# EAGLE schematic schematic (EAGLE 6.5.0)
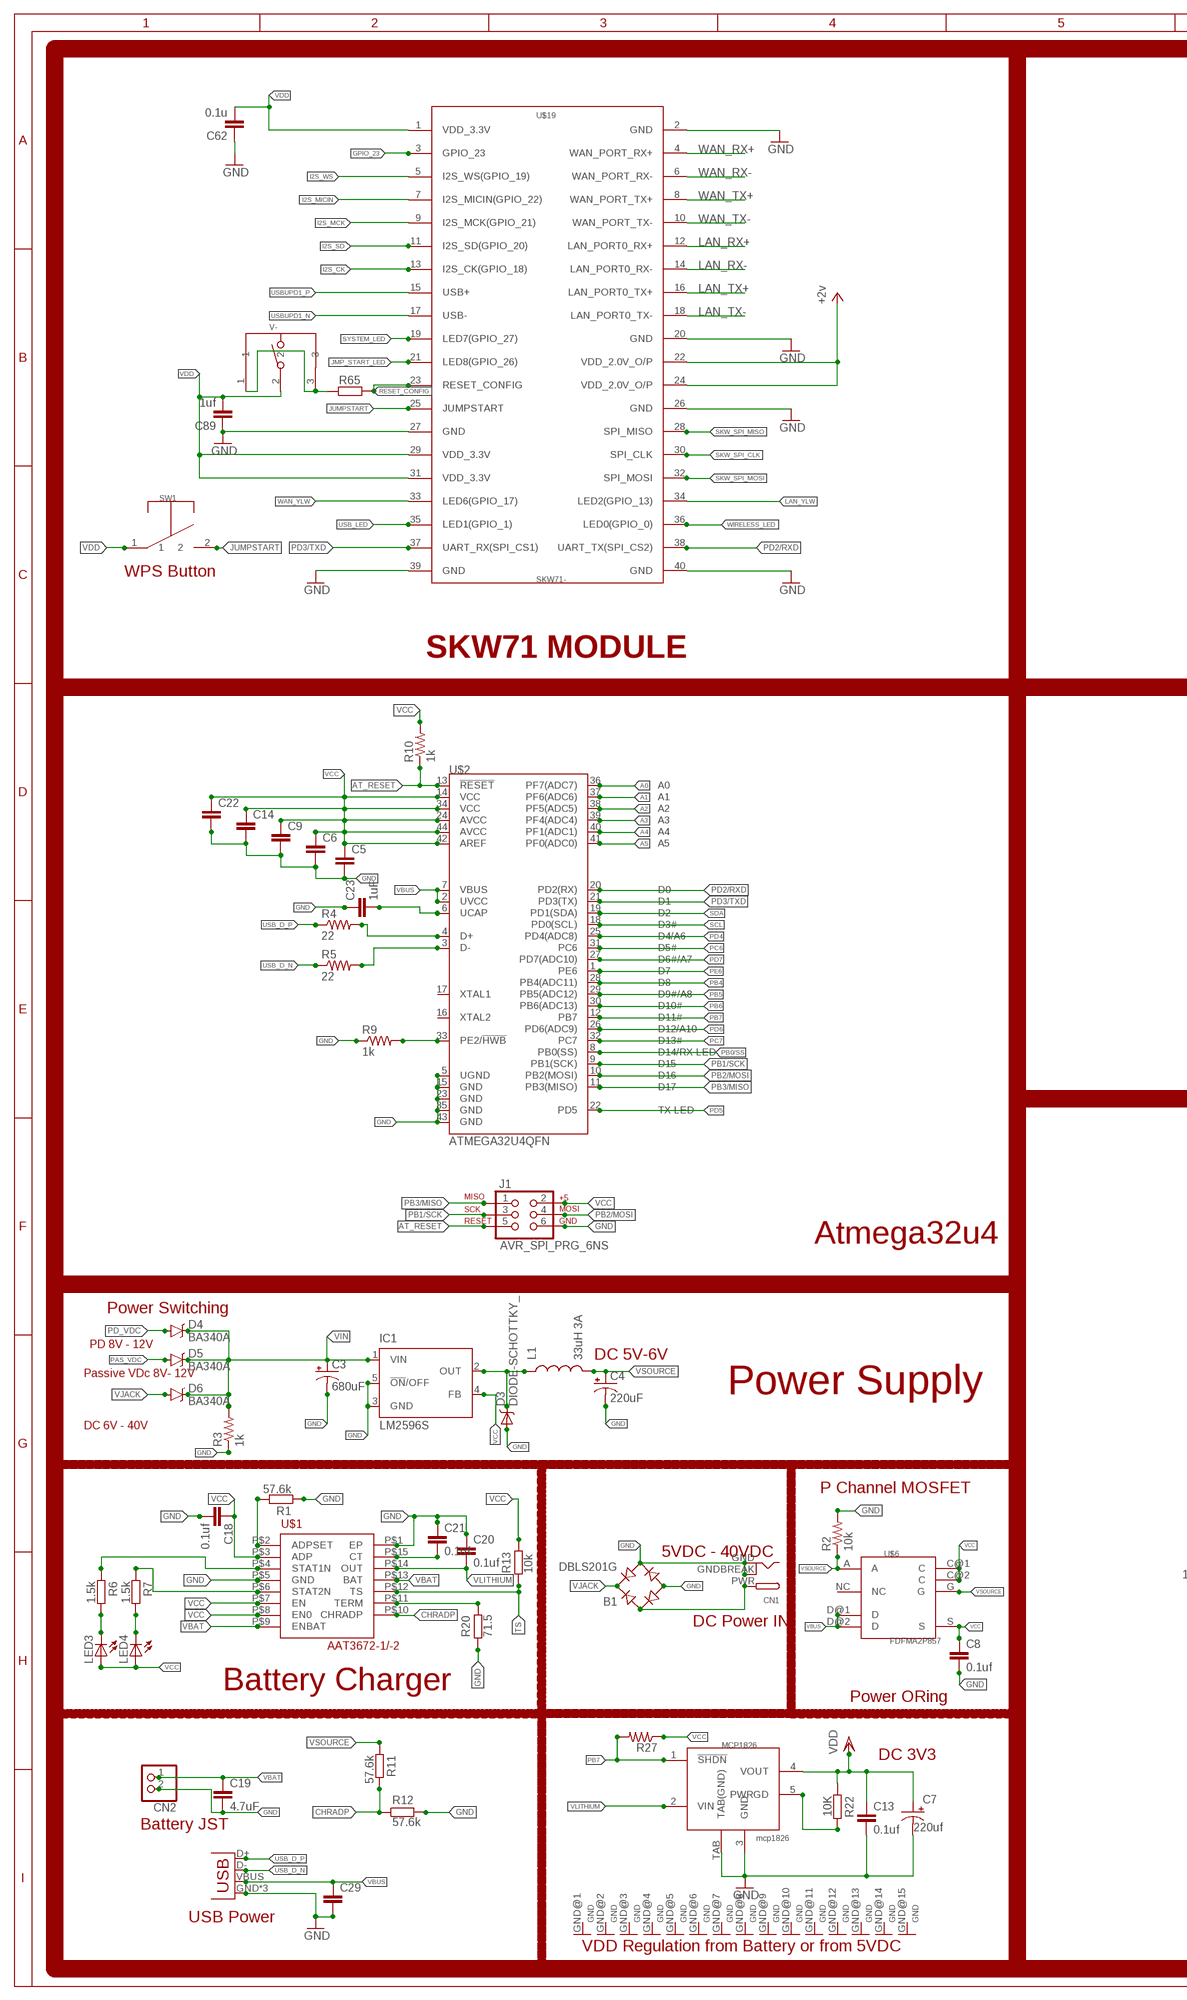
[diagram p0: schematic, sheet 1, part 1 of 2]
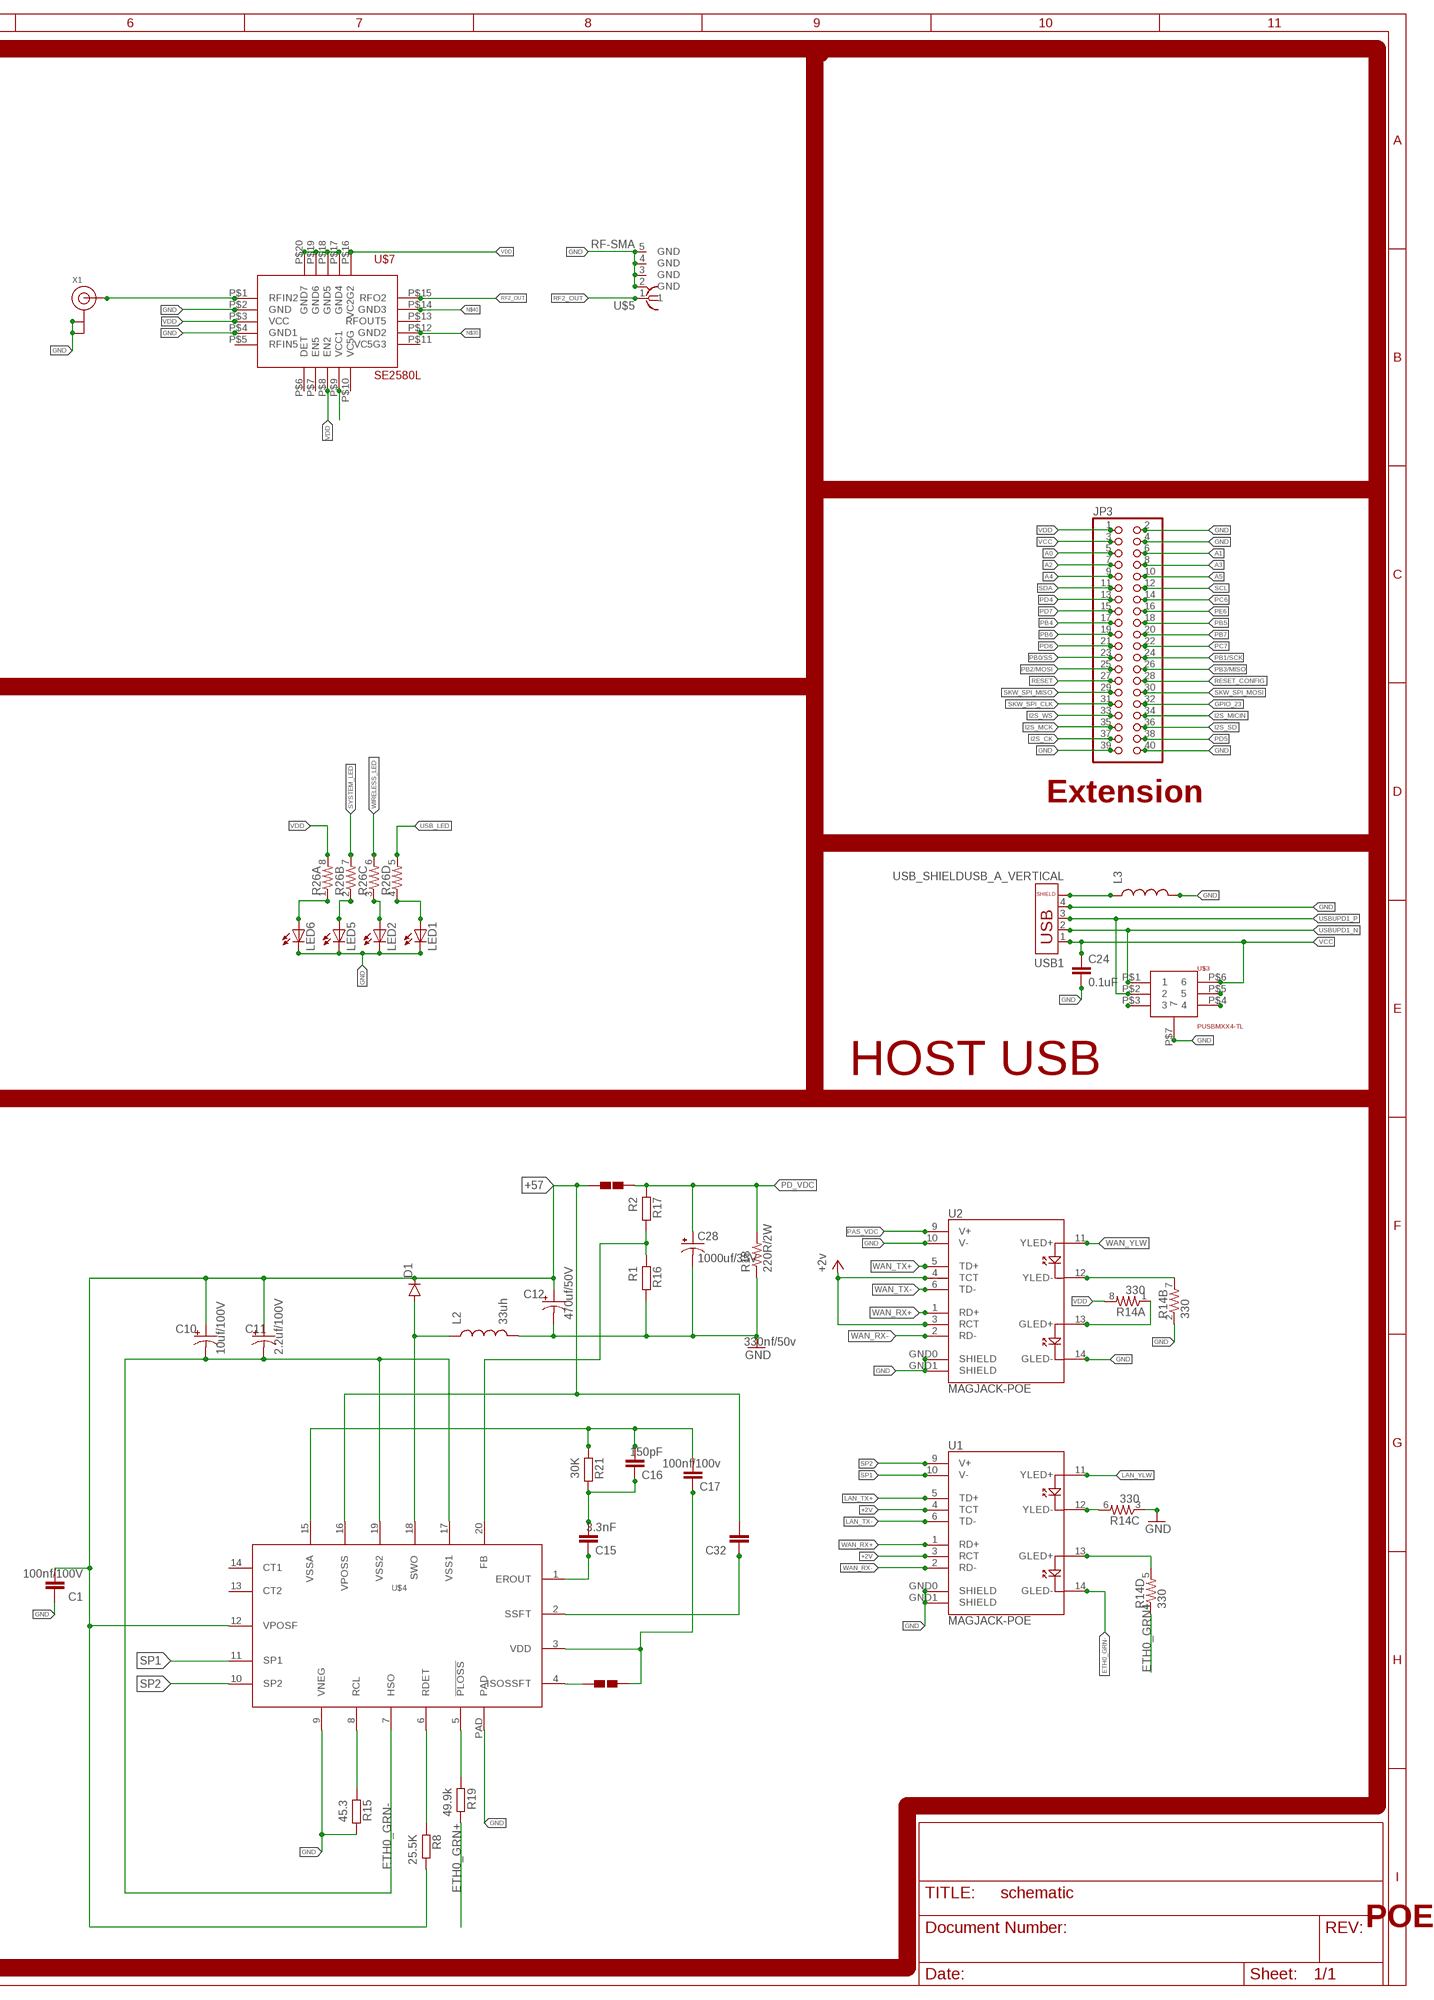
[diagram p1: schematic, sheet 1, part 2 of 2]

## Parts
B1  DBLS201G  [DBS]
C1  100nf/100V  C-EUC0805  [C0805]
C3  680uF  CPOL-USE3.5-10  [E3,5-10]
C4  220uF  CPOL-USE5-10.5  [E5-10,5]
C5  CAP0402-CAP  [0402-CAP]
C6  CAP0402-CAP  [0402-CAP]
C7  220uf  CPOL-USE5-10.5  [E5-10,5]
C8  0.1uf  C-EUC0603  [C0603]
C9  CAP0402-CAP  [0402-CAP]
C10  10uf/100V  CPOL-USE2,5-6E  [E2,5-6E]
C11  2.2uf/100V  CPOL-USE2-5  [E2-5]
C12  470uf/50V  CPOL-USE5-10.5  [E5-10,5]
C13  0.1uf  C-EUC0603  [C0603]
C14  CAP0402-CAP  [0402-CAP]
C15  3.3nF  C-EUC0805  [C0805]
C16  150pF  C-EUC0805  [C0805]
C17  100nf/100v  C-EUC0805  [C0805]
C18  0.1uf  C-EUC0603  [C0603]
C19  4.7uF  C-EUC0603  [C0603]
C20  0.1uf  C-EUC0603  [C0603]
C21  0.1uf  C-EUC0603  [C0603]
C22  CAP0402-CAP  [0402-CAP]
C23  1uF  CAP0402-CAP  [0402-CAP]
C24  0.1uF  CAP0402-CAP  [0402-CAP]
C28  1000uf/35V  CPOL-USE5-13  [E5-13]
C29  CAP0402-CAP  [0402-CAP]
C32  330nf/50v  C-EUC0805  [C0805]
C62  0.1u  CAPACITOR  [C0603]
C89  1uf  CAPACITOR  [C0603]
CN1  DCBARRELPTH  [DCJACK_2MM_PTH]
CN2  JST_2PIN-THM  [JST-PH-2-THM]
D1  DIODESMC/DO-214AB  [SMC]
D3  DIODE-SCHOTTKY_  [SMA-DIODE]
D4  BA340A  B340A  [SMA-DIODE]
D5  BA340A  B340A  [SMA-DIODE]
D6  BA340A  B340A  [SMA-DIODE]
IC1  LM2596S  [TO263-5]
J1  AVR_SPI_PRG_6NS  [2X3-NS]
JP3  PINHD-2X20  [2X20]
JP4  USB-MICROB  [USB-MICROB]
L1  33uH 3A  INDUCTOR  [INDUCTOR-10X9.8X6]
L2  33uh  INDUCTOR  [INDUCTOR-10X9.8X6]
L3  INDUCTOR0402  [C0402]
LED1  LED3MM  [LED3MM]
LED2  LED3MM  [LED3MM]
LED3  LEDCHIP-LED0603  [CHIP-LED0603]
LED4  LEDCHIP-LED0603  [CHIP-LED0603]
LED5  LED3MM  [LED3MM]
LED6  LED3MM  [LED3MM]
MCP1826  mcp1826  MCP1825T  [SOT223-5]
R1  57.6k  R-EU_R0402  [R0402]
R2  10k  RESISTOR0402-RES  [0402-RES]
R3  1k  RESISTOR0402-RES  [0402-RES]
R4  22  RESISTOR0402-RES  [0402-RES]
R5  22  RESISTOR0402-RES  [0402-RES]
R6  1.5k  R-EU_R0402  [R0402]
R7  1.5k  R-EU_R0402  [R0402]
R8  25.5K  RESISTOR  [R0603]
R9  1k  RESISTOR0402-RES  [0402-RES]
R10  1k  RESISTOR0402-RES  [0402-RES]
R11  57.6k  R-EU_R0402  [R0402]
R12  57.6k  R-EU_R0402  [R0402]
R13  10k  R-EU_R0402  [R0402]
R14  330  RESISTOR-ARRAY0603-ARV  [0603-ARV]
R15  45.3  RESISTOR  [R0603]
R16  R1  RESISTOR  [R0603]
R17  R2  RESISTOR  [R0603]
R18  220R/2W  R-US_R2512  [R2512]
R19  49.9k  RESISTOR  [R0603]
R20  71.5  R-EU_R0402  [R0402]
R21  30K  RESISTOR  [R0603]
R22  10K  R-EU_R0603  [R0603]
R26  RESISTOR-ARRAY0603-ARV  [0603-ARV]
R27  RESISTOR0402-RES  [0402-RES]
R65  RESISTOR  [R0603]
SW1  TACTILE-2PIN'  [TACTILE-2PIN-RTANGLE]
U1  MAGJACK-POE  [MAGJACK-POE]
U2  MAGJACK-POE  [MAGJACK-POE]
U$1  AAT3672-1/-2  [AAT3672-1/-2]
U$2  ATMEGA32U4QFN  [QFN-44]
U$3  PUSBMXX4-TL  [PUSBMXX4-TL]
U$4  SI3402  [SI3402]
U$5  RF-SMA  [BU-SMA-H]
U$6  FDFMA2P857  [6-WDFN-EXPOSED-PAD]
U$7  SE2580L  [SE2580L]
U$10  SOL-PAD-OPEN  [SOL-PAD-OPEN]
U$19  SKW71-  [SKW71-SMT]
U$28  SOL-PAD-OPEN  [SOL-PAD-OPEN]
USB1  USB_SHIELDUSB_A_VERTICAL  [USB_A_VERTICAL_PTH]
V-  SPST-3PIN-RTANGLEP02  [TL3340AF160QG]
X1  ANTENNA_U.FL  [U.FL]

## Nets
+2V [power]: U1.3(RCT) U1.4(TCT) U2.3(RCT) U2.4(TCT) U$19.22(VDD_2.0V_O/P) U$19.24(VDD_2.0V_O/P) ; supply symbol labelled +2v
+57 [power]: C1.2 C10.+ C11.+ C12.+ C32.2 D1.C R8.2 U$4.12(VPOSF) U$4.16(VPOSS) U$28.P$1
A0: JP3.5 U$2.36(PF7(ADC7))
A1: JP3.6 U$2.37(PF6(ADC6))
A2: JP3.7 U$2.38(PF5(ADC5))
A3: JP3.8 U$2.39(PF4(ADC4))
A4: JP3.9 U$2.40(PF1(ADC1))
A5: JP3.10 U$2.41(PF0(ADC0))
AT_RESET: J1.5 R10.1 U$2.13(!RESET)
CHRADP: R11.2 R12.1 U$1.P$10(CHRADP)
ETH0_GRN+: R14.4 R19.2
ETH0_GRN-: C10.- C11.- U1.14(GLED-) U$4.7(HSO) U$4.17(VSS1) U$4.19(VSS2)
GND: B1.- B1.AC2 C1.1 C3.- C4.- C5.2 C6.2 C7.- C8.2 C9.2 C12.- C13.2 C14.2 C18.2 C19.2 C20.1 C21.1 C22.2 C23.1 C24.2 C28.- C29.2 C62.1 C89.1 CN1.GND CN1.GNDBREAK CN2.2 D3.A IC1.3(GND) IC1.5(!ON!/OFF) J1.6 JP3.2 JP3.4 JP3.39 JP3.40 JP4.GND JP4.MT1(GND) JP4.MT2(GND) L2.P$2 L3.2 LED1.K(C) LED2.K(C) LED5.K(C) LED6.K(C) MCP1826.3(GND) MCP1826.TAB(TAB(GND)) R1.1 R2.2 R3.1 R9.1 R12.2 R14.2 R14.3 R15.2 R16.2 R18.1 R20.1 U1.GND0(SHIELD) U1.GND1(SHIELD) U2.10(V-) U2.14(GLED-) U2.GND0(SHIELD) U2.GND1(SHIELD) U$1.P$1(EP) U$1.P$5(GND) U$2.5(UGND) U$2.15(GND) U$2.23(GND) U$2.35(GND) U$2.43(GND) U$3.P$7 U$4.9(VNEG) U$4.PAD U$5.2(GND) U$5.3(GND) U$5.4(GND) U$5.5(GND) U$7.P$2(GND) U$7.P$4(GND1) U$19.2(GND) U$19.20(GND) U$19.26(GND) U$19.27(GND) U$19.39(GND) U$19.40(GND) USB1.4 X1.1(GND) X1.2(GND)
GPIO_23: JP3.32 U$19.3(GPIO_23)
I2S_CK: JP3.37 U$19.13(I2S_CK(GPIO_18))
I2S_MCK: JP3.35 U$19.9(I2S_MCK(GPIO_21))
I2S_MICIN: JP3.34 U$19.7(I2S_MICIN(GPIO_22))
I2S_SD: JP3.36 U$19.11(I2S_SD(GPIO_20))
I2S_WS: JP3.33 U$19.5(I2S_WS(GPIO_19))
JMP_START_LED: U$19.21(LED8(GPIO_26))
JUMPSTART: SW1.2 U$19.25(JUMPSTART)
LAN_RX+: U$19.12(LAN_PORT0_RX+)
LAN_RX-: U$19.14(LAN_PORT0_RX-)
LAN_TX+: U1.5(TD+) U$19.16(LAN_PORT0_TX+)
LAN_TX-: U1.6(TD-) U$19.18(LAN_PORT0_TX-)
LAN_YLW: U1.11(YLED+) U$19.34(LED2(GPIO_13))
N$2: D3.C IC1.2(OUT) L1.P$1
N$5: R1.2 U$1.P$2(ADPSET)
N$6: C16.2 C17.2 R21.1 U$4.15(VSSA)
N$7: C15.2 C16.1 R21.2
N$8: R8.1 U$4.6(RDET)
N$9: R15.1 U$4.8(RCL)
N$10: D1.A L2.P$1 U$4.18(SWO)
N$11: U$4.4(ISOSSFT) U$10.P$1
N$12: C17.1 U$4.3(VDD) U$10.P$2
N$13: C15.1 U$4.1(EROUT)
N$15: C32.1 U$4.2(SSFT)
N$16: R16.1 R17.2 U$4.20(FB)
N$18: R19.1 U$4.5(!PLOSS)
N$19: U$7.P$17(GND4) U$7.P$18(GND5) U$7.P$19(GND6) U$7.P$20(GND7)
N$20: MCP1826.5(PWRGD) R22.2
N$22: R6.1 U$1.P$4(STAT1N)
N$23: U2.11(YLED+)
N$24: R14.6 U1.12(YLED-)
N$25: R14.1 U2.13(GLED+)
N$26: R65.1 V-.1 V-.3
N$28: R7.1 U$1.P$6(STAT2N)
N$29: U$7.P$9(VCC1)
N$30: U$7.P$12(GND2)
N$31: R14.7 U2.12(YLED-)
N$32: U$3.P$3
N$33: U$3.P$4
N$34: U$3.P$5
N$36: R20.2 U$1.P$11(TERM)
N$37: C23.2 U$2.6(UCAP)
N$38: R4.2 U$2.4(D+)
N$39: R5.2 U$2.3(D-)
N$40: U$7.P$14(GND3)
N$41: L3.1 USB1.P$3
N$42: C21.2 U$1.P$15(CT)
N$43: R9.2 U$2.33(PE2/!HWB)
N$44: B1.AC1 CN1.PWR
N$45: LED6.A R26.1
N$46: LED5.A R26.2
N$47: LED4.C R7.2
N$48: LED3.C R6.2
N$50: LED2.A R26.3
N$52: LED1.A R26.4
N$54: U$7.P$1(RFIN2) X1.3(SIGNAL)
N$95: R14.5 U1.13(GLED+)
PAS_VDC: D5.A U2.9(V+)
PB0/SS: JP3.23 U$2.8(PB0(SS))
PB1/SCK: J1.3 JP3.24 U$2.9(PB1(SCK))
PB2/MOSI: J1.4 JP3.25 U$2.10(PB2(MOSI))
PB3/MISO: J1.1 JP3.26 U$2.11(PB3(MISO))
PB4: JP3.17 U$2.28(PB4(ADC11))
PB5: JP3.18 U$2.29(PB5(ADC12))
PB6: JP3.19 U$2.30(PB6(ADC13))
PB7: JP3.20 MCP1826.1(!SHDN) R27.2 U$2.12(PB7)
PC6: JP3.14 U$2.31(PC6)
PC7: JP3.22 U$2.32(PC7)
PD2/RXD: U$2.20(PD2(RX)) U$19.38(UART_TX(SPI_CS2))
PD3/TXD: U$2.21(PD3(TX)) U$19.37(UART_RX(SPI_CS1))
PD4: JP3.13 U$2.25(PD4(ADC8))
PD5: JP3.38 U$2.22(PD5)
PD6: JP3.21 U$2.26(PD6(ADC9))
PD7: JP3.15 U$2.27(PD7(ADC10))
PD_VDC: C28.+ D4.A R17.1 R18.2 U$28.P$2
PE6: JP3.16 U$2.1(PE6)
RESET: JP3.27
RESET_CONFIG: JP3.28 R65.2 U$19.23(RESET_CONFIG)
RF2_OUT: U$5.1 U$7.P$15(RFO2)
SCL: JP3.12 U$2.18(PD0(SCL))
SDA: JP3.11 U$2.19(PD1(SDA))
SKW_SPI_CLK: JP3.31 U$19.30(SPI_CLK)
SKW_SPI_MISO: JP3.29 U$19.28(SPI_MISO)
SKW_SPI_MOSI: JP3.30 U$19.32(SPI_MOSI)
SP1: U1.10(V-) U$4.11(SP1)
SP2: U1.9(V+) U$4.10(SP2)
SYSTEM_LED: R26.7 U$19.19(LED7(GPIO_27))
TS: R13.1 U$1.P$12(TS)
USB_D_N: JP4.D- R5.1
USB_D_P: JP4.D+ R4.1
USB_LED: R26.5 U$19.35(LED1(GPIO_1))
USBUPD1_N: U$3.P$1 U$19.17(USB-) USB1.2
USBUPD1_P: U$3.P$2 U$19.15(USB+) USB1.3
VBAT: C19.1 CN2.1 U$1.P$9(ENBAT) U$1.P$13(BAT)
VBUS: C29.1 JP4.VBUS U$2.2(UVCC) U$2.7(VBUS) U$6.D@1(D) U$6.D@2(D)
VCC: C5.1 C6.1 C8.1 C9.1 C14.1 C18.1 C22.1 C24.1 IC1.4(FB) J1.2 JP3.3 LED3.A LED4.A R10.2 R13.2 R27.1 U$1.P$3(ADP) U$1.P$7(EN) U$1.P$8(EN0) U$2.14(VCC) U$2.24(AVCC) U$2.34(VCC) U$2.42(AREF) U$2.44(AVCC) U$3.P$6 U$6.C@1(C) U$6.C@2(C) U$6.S USB1.1
VDD: C7.+ C13.1 C62.2 C89.2 JP3.1 MCP1826.4(VOUT) R14.8 R22.1 R26.8 SW1.1 U$7.P$3(VCC) U$7.P$8(EN2) U$7.P$16(VC2G2) U$19.1(VDD_3.3V) U$19.29(VDD_3.3V) U$19.31(VDD_3.3V) V-.2
VIN: C3.+ D4.C D5.C D6.C IC1.1(VIN) R3.2
VJACK: B1.+ D6.A
VLITHIUM: C20.2 MCP1826.2(VIN) U$1.P$14(OUT)
VSOURCE: C4.+ L1.P$2 R2.1 R11.1 U$6.A U$6.G
WAN_RX+: U1.1(RD+) U2.1(RD+) U$19.4(WAN_PORT_RX+)
WAN_RX-: U1.2(RD-) U2.2(RD-) U$19.6(WAN_PORT_RX-)
WAN_TX+: U2.5(TD+) U$19.8(WAN_PORT_TX+)
WAN_TX-: U2.6(TD-) U$19.10(WAN_PORT_TX-)
WAN_YLW: U$19.33(LED6(GPIO_17))
WIRELESS_LED: R26.6 U$19.36(LED0(GPIO_0))
Unconnected: U$2.16(XTAL2) U$2.17(XTAL1) U$4.13(CT2) U$4.14(CT1) U$6.NC U$7.P$5(RFIN5) U$7.P$6(DET) U$7.P$7(EN5) U$7.P$10(VC5G) U$7.P$11(VC5G3) U$7.P$13(RFOUT5)

## Notes on the sheet
- WPS Button
- SKW71 MODULE
- Extension
- HOST USB
- Atmega32u4
- Power Switching
- PD 8V - 12V
- DC 5V-6V
- Passive VDc 8V- 12V
- Power Supply
- DC 6V - 40V
- P Channel MOSFET
- 5VDC - 40VDC
- DC Power IN
- Battery Charger | Power ORing
- DC 3V3
- Battery JST
- USB Power
- POE
- VDD Regulation from Battery or from 5VDC

## Power pins joined to a net without a drawn wire
GND: MCP1826.GND@1(GND) MCP1826.GND@2(GND) MCP1826.GND@3(GND) MCP1826.GND@4(GND) MCP1826.GND@5(GND) MCP1826.GND@6(GND) MCP1826.GND@7(GND) MCP1826.GND@8(GND) MCP1826.GND@9(GND) MCP1826.GND@10(GND) MCP1826.GND@11(GND) MCP1826.GND@12(GND) MCP1826.GND@13(GND) MCP1826.GND@14(GND) MCP1826.GND@15(GND)

## Library data of the parts
B1 = rectifier:DB?*G: Single Phase 1.0 AMP Glass Passivated Bridge Rectifier Taiwan Semiconductor Co.,Ltd. - TSC Source: http://www.taiwansemi.com/TSCbig5/ezcatfiles/cust/img/img/db101g.pdf http://www.ts.com.tw/db/pictures/modules/PDT/PDT060207001/DBLS201G.pdf
C1 C8 C13 C15-C21 C32 = rcl:C-EU: CAPACITOR, European symbol
C3 C4 = schematic:CPOL-US: POLARIZED CAPACITOR, American symbol
C5 C6 C9 C14 C22 C23 = SparkFun:CAP: Capacitor Standard 0603 ceramic capacitor, and 0.1" leaded capacitor.
C7 C11 C28 = adafruit:CPOL-US: POLARIZED CAPACITOR, American symbol
C10 C12 = adafruit2:CPOL-US: POLARIZED CAPACITOR, American symbol
C24 C29 = SparkFun-Capacitors:CAP: Capacitor Standard 0603 ceramic capacitor, and 0.1" leaded capacitor.
C62 C89 = BaseApp:CAPACITOR: C0402 & C0603 are general chip capacitors Film Capacitor, 400V's Mouser Part No :- __ECQ-E4474KF__
CN1 = adafruit:DCBARREL: 2.0mm DC Barrel Jack DCJACK_2MM_PTH - Through Hole Jack (4UConnector: 05537)
CN2 = adafruit:JST_2PIN: JST 2-Pin Connectors of various flavors SMT-RA (S2B-PH-SM4) 4UConnector #17311 SMT (B2B-PH-SM4) THM-RA (S2B-PH) THM (B2B-PH)
D1 = SparkFun-DiscreteSemi:DIODE: Diode These are standard reverse protection diodes and small signal diodes. SMA package can handle up to about 1A. SOD-323 can handle about 200mA. What the SOD-323 package when ordering, there are some mfgs out there that are 5-pin packages.
D3 = schematic:DIODE-SCHOTTKY
D4-D6 = SparkFun-DiscreteSemi:B340A: Schottky Diode 3A-40V; PROD_ID: DIO-09886
IC1 = national-semiconductor:LM2596: SIMPLE SWITCHER® Power Converter 150 kHz 3A Step-Down Voltage Regulator Source: http://www.national.com/ds/LM/LM2596.pdf; MF: NATIONAL SEMICONDUCTOR; MPN: LM2596S-ADJ/NOPB; OC_FARNELL: 9494367; OC_NEWARK: 41K3842
J1 = Sensor Mesh:AVR_SPI_PRG_6: AVR ISP 6 Pin This is the reduced ISP connector for AVR programming. Common on Arduino. This footprint will take up less PCB space and can be used with a 10-pin to 6-pin adapter such as SKU: BOB-08508
JP3 = pinhead:PINHD-2X20: PIN HEADER
JP4 = SparkFun-Connectors:USB: USB Connectors USB-B-PTH is fully proven SKU : PRT-00139/CONN-08278 USB-miniB is fully proven SKU : PRT-00587 USB-A-PCB is untested. USB-A-H is throughly reviewed, but untested. Spark Fun Electronics SKU : PRT-00437 USB-B-SMT is throughly reviewed, but untested. Needs silkscreen touching up. USB-A-S has not been used/tested USB-MB-H has not been used/tested USB-MICROB has been used. CONN-09505; PROD_ID: CONN-09505
L1 = schematic:INDUCTOR
L2 = BaseApp:INDUCTOR
L3 = SparkFun-Passives:INDUCTOR: Inductors Basic Inductor/Choke - 0603 and 1206. Footprints are not proven and vary greatly between part numbers. SRN6045- 33uH, 20% 1.4A SDR0403-560KL - 56uH, 10%, 500mA RMS/740mA peak
LED1-LED6 = led:LED: LED OSRAM: - CHIPLED LG R971, LG N971, LY N971, LG Q971, LY Q971, LO R971, LY R971 LH N974, LH R974 LS Q976, LO Q976, LY Q976 LO Q996 - Hyper CHIPLED LW Q18S LB Q993, LB Q99A, LB R99A - SideLED LS A670, LO A670, LY A670, LG A670, LP A670 LB A673, LV A673, LT A673, LW A673 LH A674 LY A675 LS A676, LA A676, LO A676, LY A676, LW A676 LS A679, LY A679, LG A679 - Hyper Micro SIDELED® LS Y876, LA Y876, LO Y876, LY Y876 LT Y87S - SmartLED LW L88C, LW L88S LB L89C, LB L89S, LG L890 LS L89K, LO L89K, LY L89K LS L896, LA L896, LO L896, LY L896 - TOPLED LS T670, LO T670, LY T670, LG T670, LP T670 LSG T670, LSP T670, LSY T670, LOP T670, LYG T670 LG T671, LOG T671, LSG T671 LB T673, LV T673, LT T673, LW T673 LH T674 LS T676, LA T676, LO T676, LY T676, LB T676, LH T676, LSB T676, LW T676 LB T67C, LV T67C, LT T67C, LS T67K, LO T67K, LY T67K, LW E67C LS E67B, LA E67B, LO E67B, LY E67B, LB E67C, LV E67C, LT E67C LW T67C LS T679, LY T679, LG T679 LS T770, LO T770, LY T770, LG T770, LP T770 LB T773, LV T773, LT T773, LW T773 LH T774 LS E675, LA E675, LY E675, LS T675 LS T776, LA T776, LO T776, LY T776, LB T776 LHGB T686 LT T68C, LB T68C - Hyper Mini TOPLED® LB M676 - Mini TOPLED Santana® LG M470 LS M47K, LO M47K, LY M47K Source: http://www.osram.convergy.de LUXEON: - LUMILED® LXK2-PW12-R00, LXK2-PW12-S00, LXK2-PW14-U00, LXK2-PW14-V00 LXK2-PM12-R00, LXK2-PM12-S00, LXK2-PM14-U00 LXK2-PE12-Q00, LXK2-PE12-R00, LXK2-PE12-S00, LXK2-PE14-T00, LXK2-PE14-U00 LXK2-PB12-K00, LXK2-PB12-L00, LXK2-PB12-M00, LXK2-PB14-N00, LXK2-PB14-P00, LXK2-PB14-Q00 LXK2-PR12-L00, LXK2-PR12-M00, LXK2-PR14-Q00, LXK2-PR14-R00 LXK2-PD12-Q00, LXK2-PD12-R00, LXK2-PD12-S00 LXK2-PH12-R00, LXK2-PH12-S00 LXK2-PL12-P00, LXK2-PL12-Q00, LXK2-PL12-R00 Source: www.luxeon.com KINGBRIGHT: KA-3528ASYC Source: www.kingbright.com
MCP1826 = BaseApp:MCP1825T: Digikey No:- __MCP1825T-5002E/DCCT-ND__
R1 R6 R7 R11-R13 R20 R22 = resistor:R-EU_: RESISTOR, European symbol
R2 R3 R27 = SparkFun-Passives:RESISTOR: Resistor Basic schematic elements and footprints for 0603, 1206, and PTH resistors.
R4 R5 R9 R10 = SparkFun:RESISTOR: Resistor Basic schematic elements and footprints for 0603, 1206, and PTH resistors.
R8 R15-R17 R19 R21 R65 = BaseApp:RESISTOR: Resistance Package :- 0603 Mount :-Surface mount
R14 R26 = SparkFun-Passives:RESISTOR-ARRAY: Array Chip Resistor Source: RS Component / Phycomp
R18 = adafruit:R-US_: RESISTOR, American symbol
SW1 = BaseApp:TACTILE-2PIN: Digikey No. :- 450-1758-1-ND
U1 U2 = SparkFun-Connectors:MAGJACK-POE: PoE compatible MagJack
U$1 = schematic:AAT3672-1/-2
U$2 = SparkFun-DigitalIC:ATMEGA32U4: Atmel 44-pin 8-bit Microcontroller with 32KBytes of ISP Flash and USB Controller
U$3 = schematic:PUSBMXX4-TL
U$4 = BaseApp:SI3402: FULLY-INTEGRATED 802.3-COMPLIANT POE PD INTERFACE AND LOW-EMI SWITCHING REGULATOR
U$5 = BaseApp:RF-SMA
U$6 = BaseApp:FDFMA2P857
U$7 = schematic:SE2580L
U$10 U$28 = BaseApp:SOL-PAD-OPEN
U$19 = BaseApp:SKW71
USB1 = schematic:USB_SHIELD
V- = BaseApp:SPST-3PIN-RTANGLE: Digikey No. :- __EG4627CT-ND__
X1 = adafruit:ANTENNA_U.FL: U.FL Antenna Connector

## Net classes
0 default: width 0.127 mm, drill 0.127 mm, clearance 0.127 mm
1 power: width 0.406 mm, drill 1.1 mm, clearance 0.2 mm
2 gnd: width 0.2 mm, drill 0.305 mm, clearance 0.2 mm